# Altium schematic sheet 核心板.SchDoc
size A4
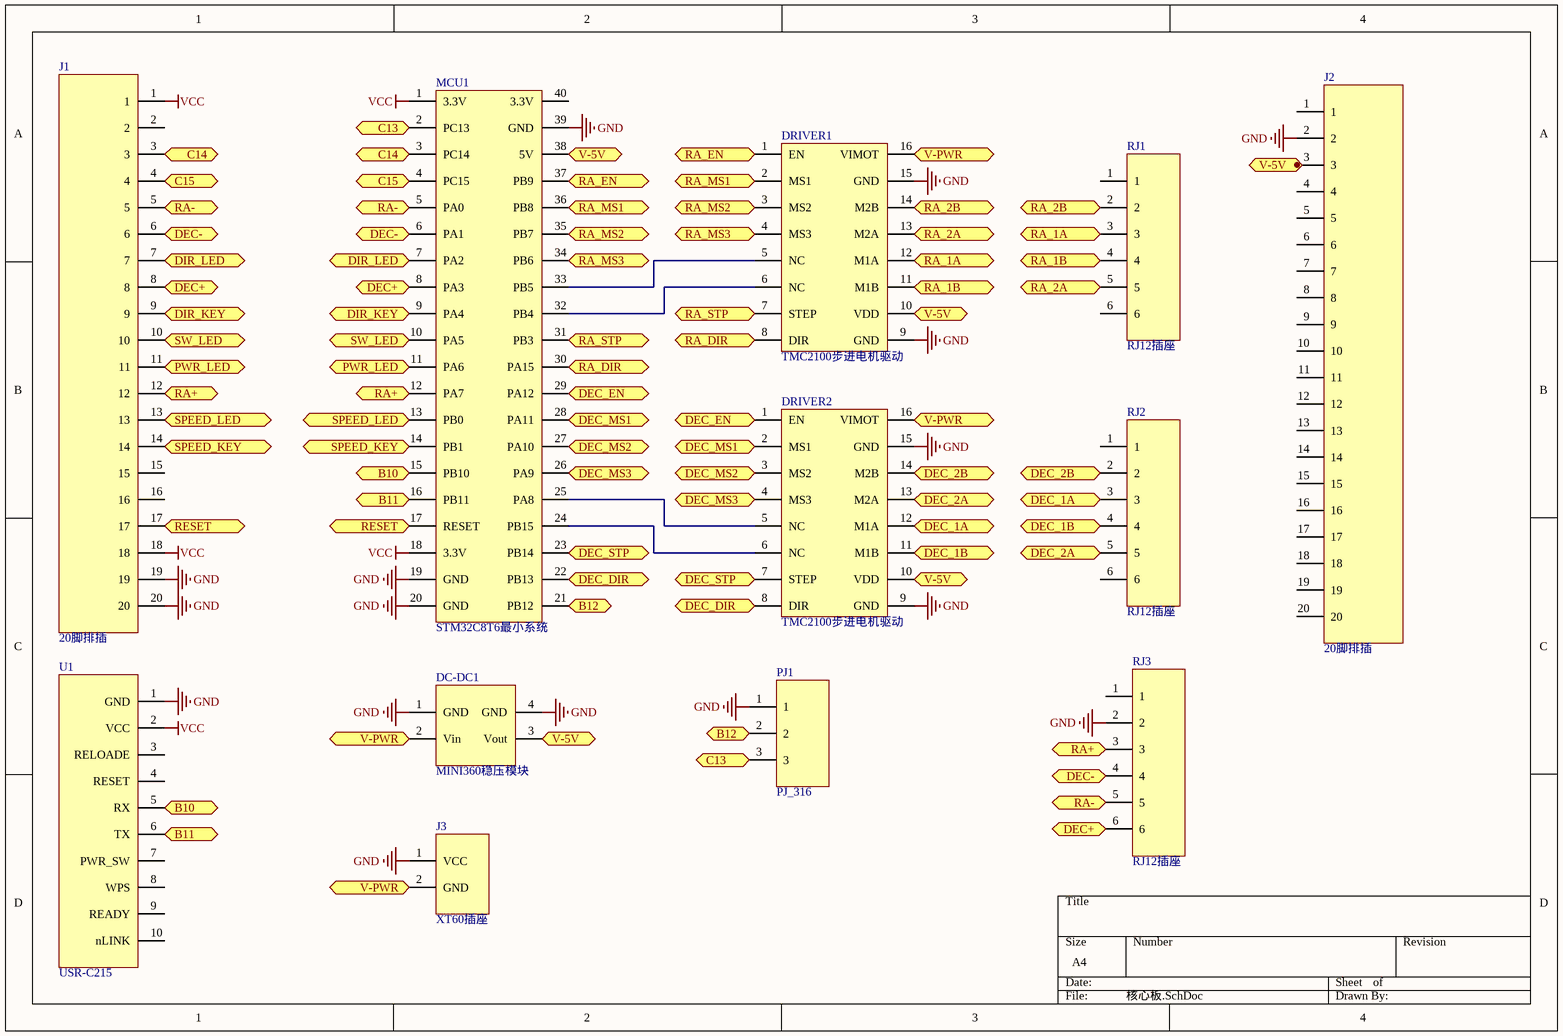
[diagram p0: 核心板.SchDoc]

## Parts
DC-DC1  MINI360稳压模块  [mini360]
DRIVER1  TMC2100步进电机驱动  [DIP16]
DRIVER2  TMC2100步进电机驱动  [DIP16]
J1  20脚排插  [SIP20]
J2  20脚排插  [SIP20]
J3  XT60插座
MCU1  STM32C8T6最小系统  [DIP40]
PJ1  PJ_316  [PJ_316]
RJ1  RJ12插座  [RJ12]
RJ2  RJ12插座  [RJ12]
RJ3  RJ12插座  [RJ12]
U1  USR-C215  [USR_C215]

## Ports
B10, B11, B12, C13, C14, C15, DEC+, DEC-, DEC_1A, DEC_1B, DEC_2A, DEC_2B, DEC_DIR, DEC_EN, DEC_MS1, DEC_MS2, DEC_MS3, DEC_STP, DIR_KEY, DIR_LED, PWR_LED, RA+, RA-, RA_1A, RA_1B, RA_2A, RA_2B, RA_DIR, RA_EN, RA_MS1, RA_MS2, RA_MS3, RA_STP, RESET, SPEED_KEY, SPEED_LED, SW_LED, V-5V, V-PWR

## Nets
GND: DC-DC1.1(GND) DC-DC1.4(GND) DRIVER1.9(GND) DRIVER1.15(GND) DRIVER2.9(GND) DRIVER2.15(GND) J1.19 J1.20 J2.2 J3.1(VCC) MCU1.19(GND) MCU1.20(GND) MCU1.39(GND) PJ1.1 RJ3.2 U1.1(GND)
VCC: J1.1 J1.18 MCU1.1(3.3V) MCU1.18(3.3V) U1.2(VCC)
B10: MCU1.15(PB10) U1.5(RX) ; port B10
B11: MCU1.16(PB11) U1.6(TX) ; port B11
B12: MCU1.21(PB12) PJ1.2 ; port B12
C13: MCU1.2(PC13) PJ1.3 ; port C13
C14: J1.3 MCU1.3(PC14) ; port C14
C15: J1.4 MCU1.4(PC15) ; port C15
DEC+: J1.8 MCU1.8(PA3) RJ3.6 ; port DEC+
DEC-: J1.6 MCU1.6(PA1) RJ3.4 ; port DEC-
DEC_1A: DRIVER2.12(M1A) RJ2.3 ; port DEC_1A
DEC_1B: DRIVER2.11(M1B) RJ2.4 ; port DEC_1B
DEC_2A: DRIVER2.13(M2A) RJ2.5 ; port DEC_2A
DEC_2B: DRIVER2.14(M2B) RJ2.2 ; port DEC_2B
DEC_DIR: DRIVER2.8(DIR) MCU1.22(PB13) ; port DEC_DIR
DEC_EN: DRIVER2.1(EN) MCU1.29(PA12) ; port DEC_EN
DEC_MS1: DRIVER2.2(MS1) MCU1.28(PA11) ; port DEC_MS1
DEC_MS2: DRIVER2.3(MS2) MCU1.27(PA10) ; port DEC_MS2
DEC_MS3: DRIVER2.4(MS3) MCU1.26(PA9) ; port DEC_MS3
DEC_STP: DRIVER2.7(STEP) MCU1.23(PB14) ; port DEC_STP
DIR_KEY: J1.9 MCU1.9(PA4) ; port DIR_KEY
DIR_LED: J1.7 MCU1.7(PA2) ; port DIR_LED
PWR_LED: J1.11 MCU1.11(PA6) ; port PWR_LED
RA+: J1.12 MCU1.12(PA7) RJ3.3 ; port RA+
RA-: J1.5 MCU1.5(PA0) RJ3.5 ; port RA-
RA_1A: DRIVER1.12(M1A) RJ1.3 ; port RA_1A
RA_1B: DRIVER1.11(M1B) RJ1.4 ; port RA_1B
RA_2A: DRIVER1.13(M2A) RJ1.5 ; port RA_2A
RA_2B: DRIVER1.14(M2B) RJ1.2 ; port RA_2B
RA_DIR: DRIVER1.8(DIR) MCU1.30(PA15) ; port RA_DIR
RA_EN: DRIVER1.1(EN) MCU1.37(PB9) ; port RA_EN
RA_MS1: DRIVER1.2(MS1) MCU1.36(PB8) ; port RA_MS1
RA_MS2: DRIVER1.3(MS2) MCU1.35(PB7) ; port RA_MS2
RA_MS3: DRIVER1.4(MS3) MCU1.34(PB6) ; port RA_MS3
RA_STP: DRIVER1.7(STEP) MCU1.31(PB3) ; port RA_STP
RESET: J1.17 MCU1.17(RESET) ; port RESET
SPEED_KEY: J1.14 MCU1.14(PB1) ; port SPEED_KEY
SPEED_LED: J1.13 MCU1.13(PB0) ; port SPEED_LED
SW_LED: J1.10 MCU1.10(PA5) ; port SW_LED
V-5V: DC-DC1.3(Vout) DRIVER1.10(VDD) DRIVER2.10(VDD) MCU1.38(5V) ; port V-5V
V-PWR: DC-DC1.2(Vin) DRIVER1.16(VIMOT) DRIVER2.16(VIMOT) J3.2(GND) ; port V-PWR
NetDRIVER1_5: DRIVER1.5(NC) MCU1.33(PB5)
NetDRIVER1_6: DRIVER1.6(NC) MCU1.32(PB4)
NetDRIVER2_5: DRIVER2.5(NC) MCU1.25(PA8)
NetDRIVER2_6: DRIVER2.6(NC) MCU1.24(PB15)

Not connected (* = marked no-connect by the designer): J1 2 15 16; J2 1 3 4 5 6 7 8 9 10 11 12 13 14 15 16 17 18 19 20; MCU1 40(3.3V); RJ1 1 6; RJ2 1 6; RJ3 1; U1 3(RELOADE) 4(RESET) 7(PWR_SW) 8(WPS) 9(READY) 10(nLINK)